# Altium project SFP_Flex_PCB_2_0.PrjPcb
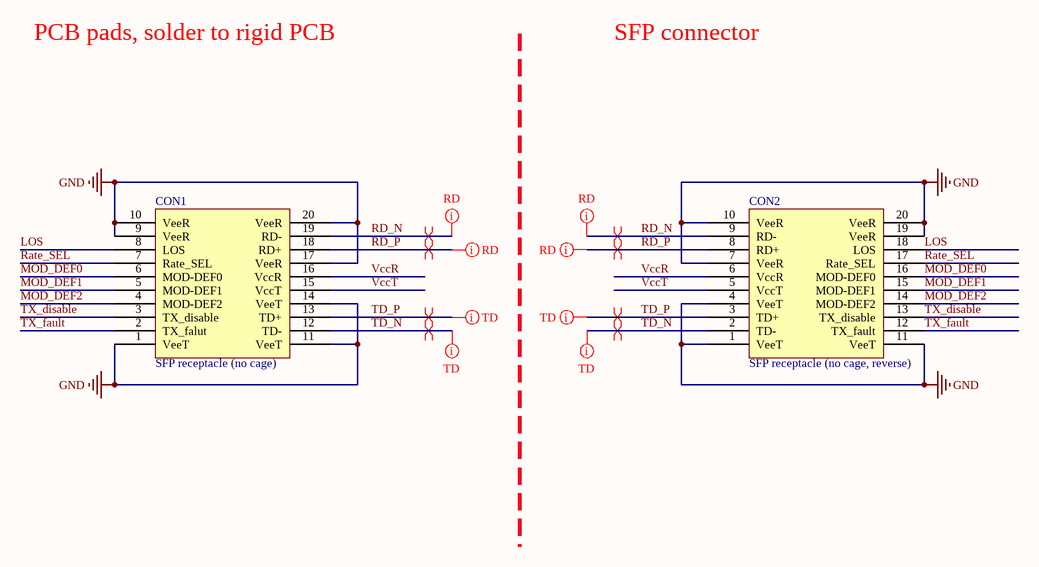
[diagram p0: Sheet_connectors.SchDoc]
1 sheet, 2 parts. Net scope: global (net labels, ports and power ports of the same name join across sheets).
Board file: PCB_Flex.PcbDoc

## Sheet Sheet_connectors.SchDoc
size A4

### Parts
CON1  SFP receptacle (no cage)  [SFP PCB CON]
CON2  SFP receptacle (no cage, reverse)  [SFP receptacle (no cage)]

### Nets
GND: CON1.1(VeeT) CON1.9(VeeR) CON1.10(VeeR) CON1.11(VeeT) CON1.14(VeeT) CON1.17(VeeR) CON1.20(VeeR) CON2.1(VeeT) CON2.4(VeeT) CON2.7(VeeR) CON2.10(VeeR) CON2.11(VeeT) CON2.19(VeeR) CON2.20(VeeR)
LOS: CON1.8(LOS) CON2.18(LOS)
MOD_DEF0: CON1.6(MOD-DEF0) CON2.16(MOD-DEF0)
MOD_DEF1: CON1.5(MOD-DEF1) CON2.15(MOD-DEF1)
MOD_DEF2: CON1.4(MOD-DEF2) CON2.14(MOD-DEF2)
Rate_SEL: CON1.7(Rate_SEL) CON2.17(Rate_SEL)
RD_N: CON1.19(RD-) CON2.9(RD-)
RD_P: CON1.18(RD+) CON2.8(RD+)
TD_N: CON1.12(TD-) CON2.2(TD-)
TD_P: CON1.13(TD+) CON2.3(TD+)
TX_disable: CON1.3(TX_disable) CON2.13(TX_disable)
TX_fault: CON1.2(TX_falut) CON2.12(TX_fault)
VccR: CON1.16(VccR) CON2.6(VccR)
VccT: CON1.15(VccT) CON2.5(VccT)

### Layout directives
differential pair: RD_N, RD_P, TD_N, TD_P
net class RD: RD_N, RD_P
net class TD: TD_N, TD_P

### Notes on the sheet
- PCB pads, solder to rigid PCB
- SFP connector

### Library data of the parts
CON1 = SFP connector: SFP receptacle, woutout cage, standard orientation of SFP module; Implementation: YES; Datasheet: *; Manifacturer: *; Manifacturer code: *; Value: *; Supplier 1: Farnell; Supplier Part Number 1: 1629987
CON2 = SFP connector reverse: SFP receptacle, woutout cage, reverse orientation of SFP module; Implementation: YES; Supplier 1: Farnell; Supplier Part Number 1: 1629987; Datasheet: *; Manifacturer: *; Manifacturer code: *; Value: *